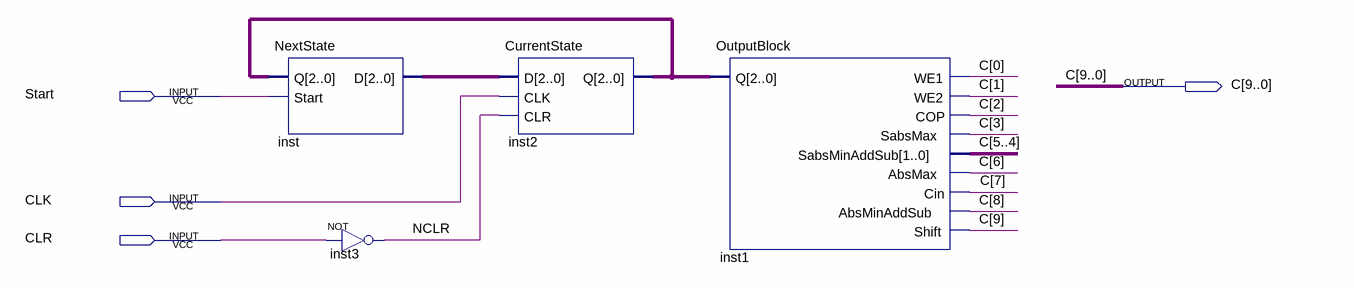
[diagram p0: schematic sheet]
// Quartus schematic Control.bdf as structural Verilog: 4 symbols, 4 pins
module Control (
  input  Start,
  input  CLK,
  input  CLR,
  output [9:0] C
);

  wire NCLR;
  wire [2:0] inst2_q, inst_d;

  NextState inst (.Q(inst2_q), .Start(Start), .D(inst_d));
  not inst3 (NCLR, CLR);
  CurrentState inst2 (.D(inst_d), .CLK(CLK), .CLR(NCLR), .Q(inst2_q));
  OutputBlock inst1 (
    .Q(inst2_q), .WE1(C[0]), .WE2(C[1]), .COP(C[2]), .SabsMax(C[3]), .SabsMinAddSub(C[5:4]), .AbsMax(C[6]),
    .Cin(C[7]), .AbsMinAddSub(C[8]), .Shift(C[9]));
endmodule
